# Altium schematic sheet Connectors.SchDoc
size A4; SheetNumber: 4; SheetTotal: 3
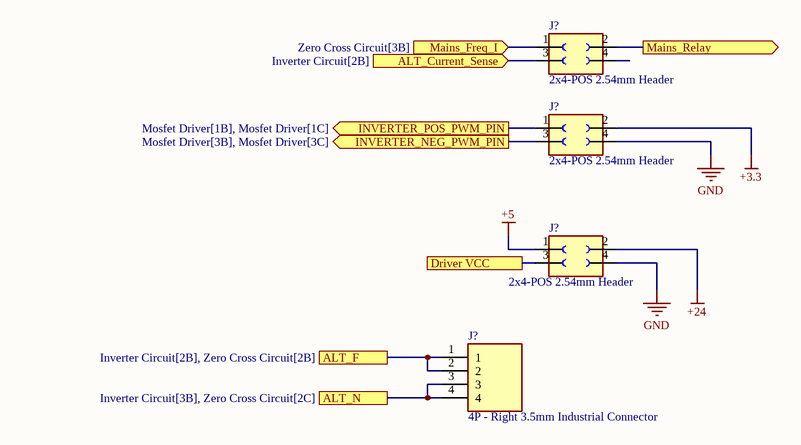
[diagram p0: Connectors.SchDoc]

## Parts
(Parts that share a designator on the sheet are numbered #1, #2 ... from top to bottom, then left to right.)
J?#1  2x4-POS 2.54mm Header  [2x4-POS 2.54mm Header]
J?#2  2x4-POS 2.54mm Header  [2x4-POS 2.54mm Header]
J?#3  2x4-POS 2.54mm Header  [2x4-POS 2.54mm Header]
J?#4  4P - Right 3.5mm Industrial Connector  [4P - Right 3.5mm Industrial Connector]

## Ports
ALT_Current_Sense (in, see Inverter Circuit[2B]), ALT_F (see Inverter Circuit[2B], Zero Cross Circuit[2B]), ALT_N (see Inverter Circuit[3B], Zero Cross Circuit[2C]), Driver VCC, INVERTER_NEG_PWM_PIN (out, see Mosfet Driver[3B], Mosfet Driver[3C]), INVERTER_POS_PWM_PIN (out, see Mosfet Driver[1B], Mosfet Driver[1C]), Mains_Freq_I (in, see Zero Cross Circuit[3B]), Mains_Relay (out)

## Nets
+3.3: J?#2.2
+5: J?#3.1
+24: J?#3.2
GND: J?#2.4 J?#3.4
ALT_Current_Sense: J?#1.3 ; port ALT_Current_Sense
ALT_F: J?#4.1 J?#4.2 ; port ALT_F
ALT_N: J?#4.3 J?#4.4 ; port ALT_N
Driver VCC: J?#3.3 ; port Driver VCC
INVERTER_NEG_PWM_PIN: J?#2.3 ; port INVERTER_NEG_PWM_PIN
INVERTER_POS_PWM_PIN: J?#2.1 ; port INVERTER_POS_PWM_PIN
Mains_Freq_I: J?#1.1 ; port Mains_Freq_I
Mains_Relay: J?#1.2 ; port Mains_Relay

Not connected (* = marked no-connect by the designer): J?#1 4(3)

## Library data of the parts
J?#1-J?#3 = 2x4-POS 2.54mm Header: Female header [WÃ¼rth Elektronik] 613004243121 Female header; SnapEDA_Link: https://www.snapeda.com/parts/613004243121/W%C3%BCrth%20Elektronik/view-part/1737074/?ref=snap; Check_prices: https://www.snapeda.com/parts/613004243121/W%C3%BCrth%20Elektronik/view-part/1737074/?ref=eda; Availability: Unavailable; Value: *; MF: WÃ¼rth Elektronik; Price: None; MP: 613004243121; Package: None
J?#4 = 4P - Right 3.5mm Industrial Connector: MP: 5-146290-4; Package: None; Price: None; Value: *; Availability: Unavailable